# Altium schematic sheet tms320f28388d_core_board_b.SchDoc
size A3; SheetNumber: 2; SheetTotal: 3
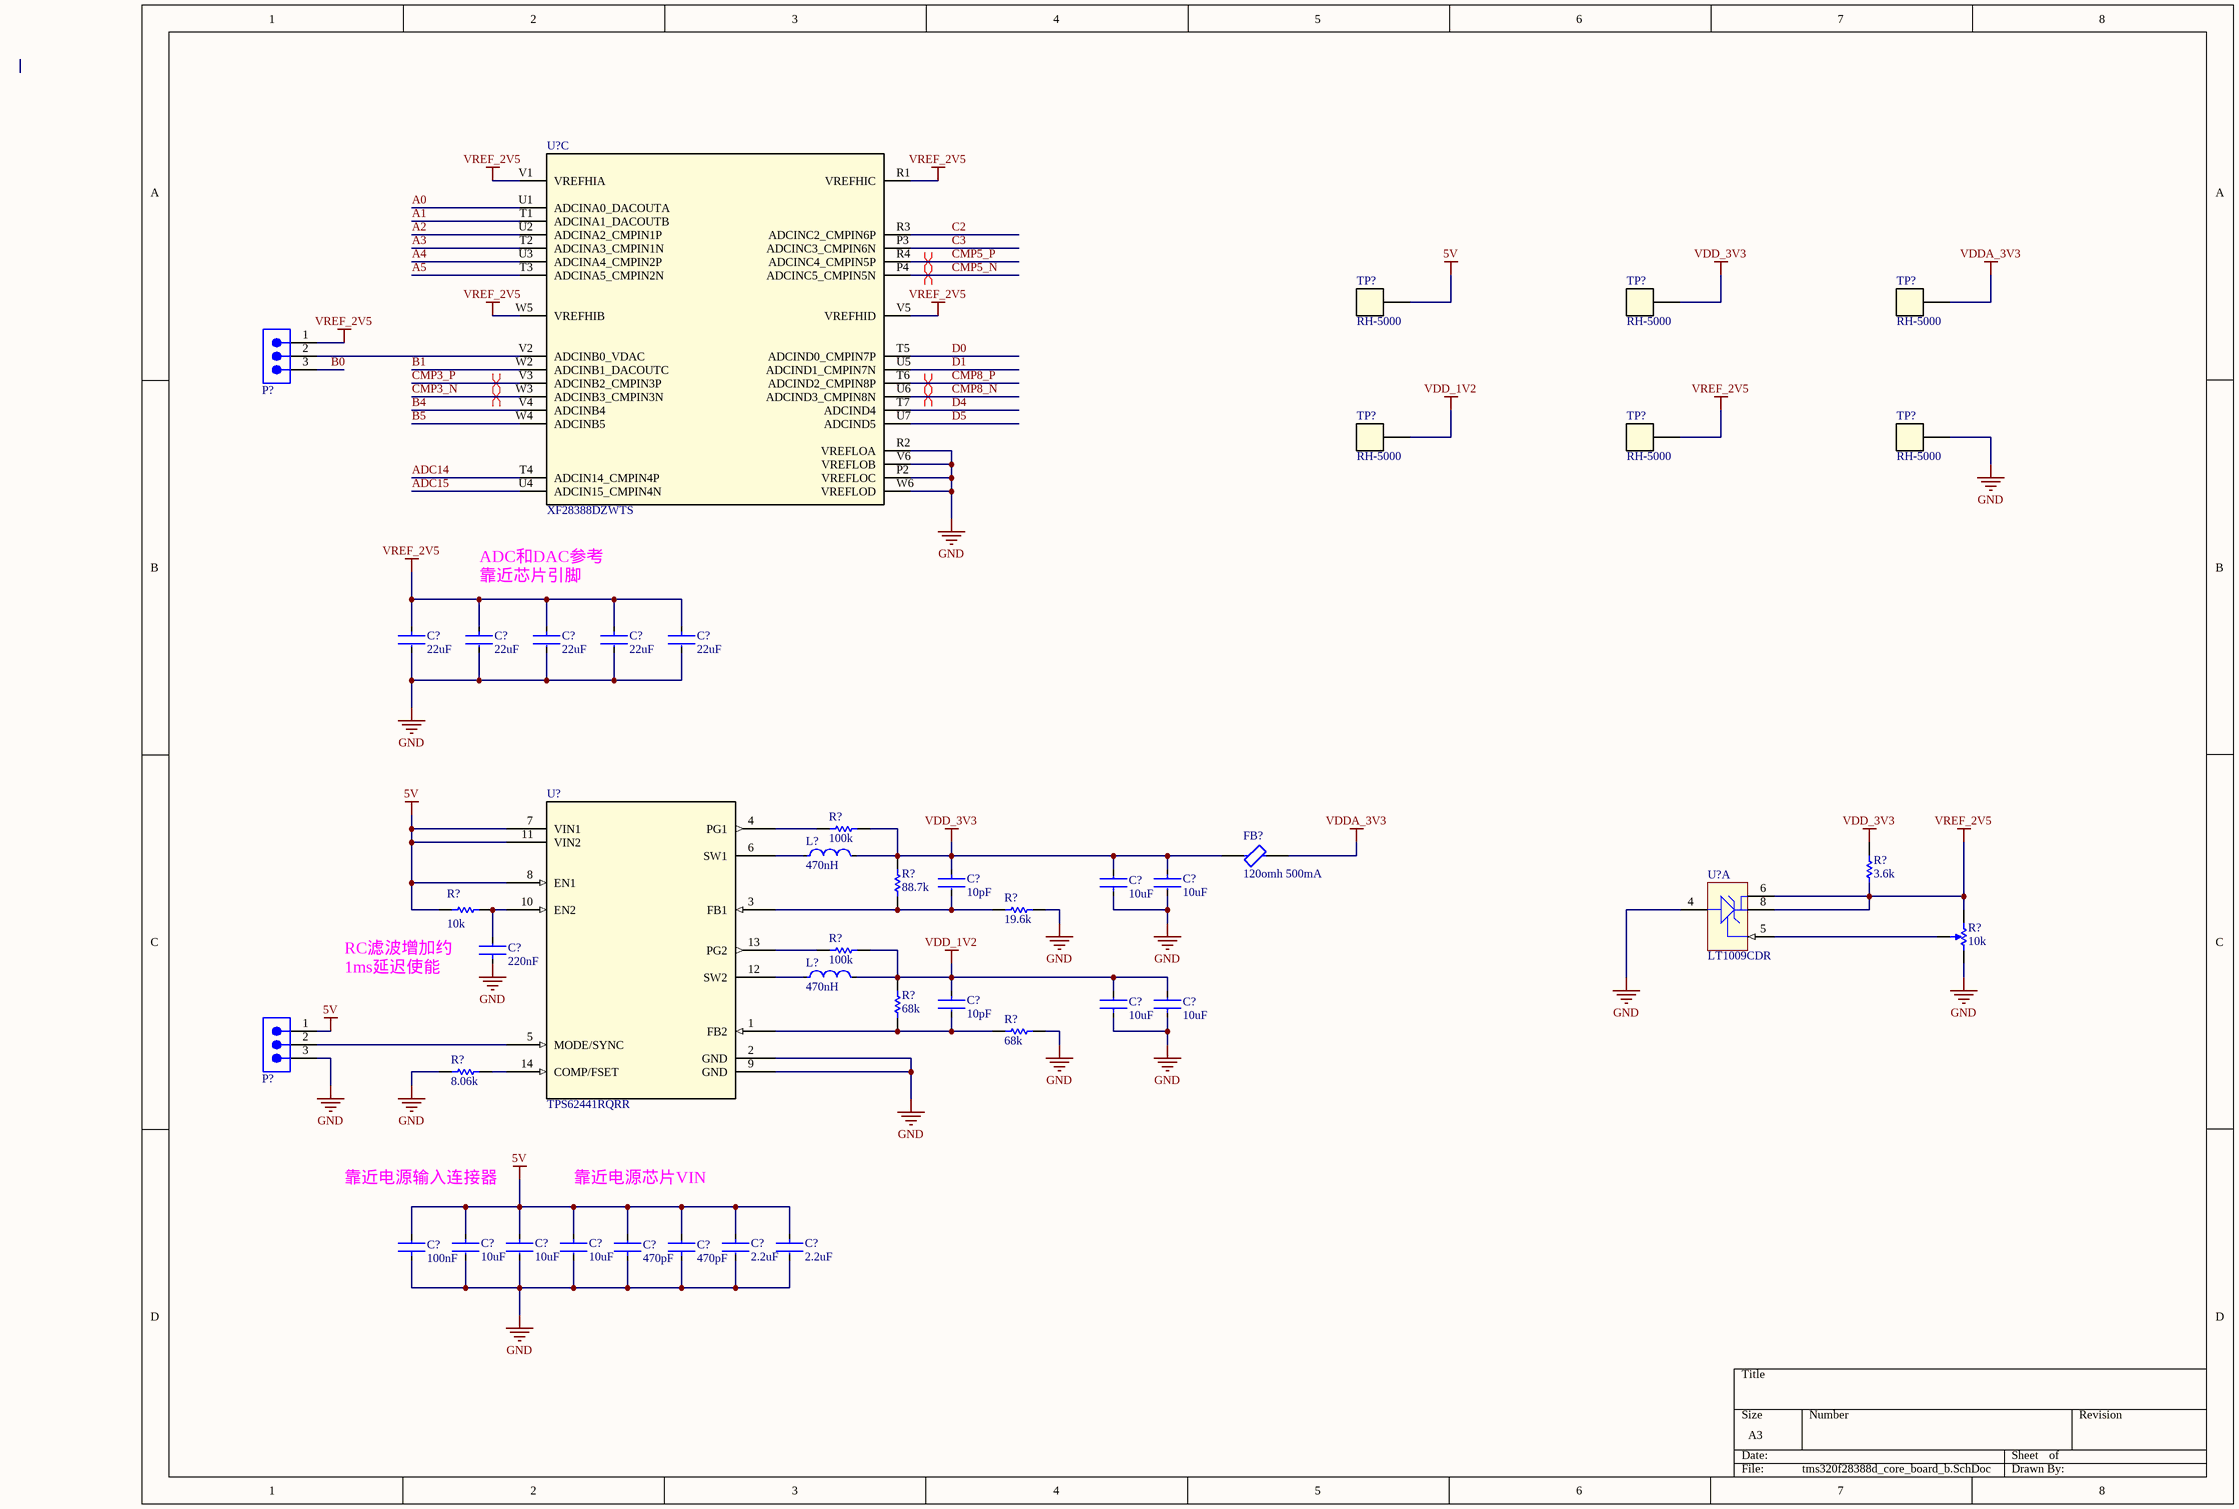
[diagram p0: tms320f28388d_core_board_b.SchDoc]

## Parts
(Parts that share a designator on the sheet are numbered #1, #2 ... from top to bottom, then left to right.)
C?#1  22uF  [FP-GRM158-0_2-MFG]
C?#2  22uF  [FP-GRM158-0_2-MFG]
C?#3  22uF  [FP-GRM158-0_2-MFG]
C?#4  22uF  [FP-GRM158-0_2-MFG]
C?#5  22uF  [FP-GRM158-0_2-MFG]
C?#6  10pF  [FP-GCM155-0_05-MFG]
C?#7  10uF  [FP-GRM188-0_2-MFG]
C?#8  10uF  [FP-GRM188-0_2-MFG]
C?#9  220nF  [FP-GRM155-0_05-MFG]
C?#10  10pF  [FP-GCM155-0_05-MFG]
C?#11  10uF  [FP-GRM188-0_2-MFG]
C?#12  10uF  [FP-GRM188-0_2-MFG]
C?#13  10uF  [FP-GRM188-0_2-MFG]
C?#14  10uF  [FP-GRM188-0_2-MFG]
C?#15  10uF  [FP-GRM188-0_2-MFG]
C?#16  2.2uF  [FP-GRM188-0_1-e0_2_0_5-MFG]
C?#17  2.2uF  [FP-GRM188-0_1-e0_2_0_5-MFG]
C?#18  100nF  [FP-CC0402-MFG]
C?#19  470pF  [FP-0402-L_1_0_1-W_0_5_0_1-MFG]
C?#20  470pF  [FP-0402-L_1_0_1-W_0_5_0_1-MFG]
FB?  120omh 500mA  [FP-MMZ1005-MFG]
L?#1  470nH  [FP-DFE252012C-MFG]
L?#2  470nH  [FP-DFE252012C-MFG]
P?#1  TSW-103-07-G-S  [SMTC-TSW-103-07-X-S]  (value not drawn)
P?#2  TSW-103-07-G-S  [SMTC-TSW-103-07-X-S]  (value not drawn)
R?#1  100k  [RESC1005X40X25NL05T10]
R?#2  3.6k  [RESC1005X40X25ML05T10]
R?#3  88.7k  [RESC1005X40X25NL05T05]
R?#4  19.6k  [RESC1005X40X25NL05T05]
R?#5  10k  [FP-RT0402-MFG]
R?#6  10k  [BOUR-TC33X-2_V]
R?#7  100k  [RESC1005X40X25NL05T10]
R?#8  68k  [RESC1005X40X25NL05T05]
R?#9  68k  [RESC1005X40X25NL05T05]
R?#10  8.06k  [RESC1005X40X25NL05T05]
TP?#1  RH-5000  [FP-5000-MFG]
TP?#2  RH-5000  [FP-5000-MFG]
TP?#3  RH-5000  [FP-5000-MFG]
TP?#4  RH-5000  [FP-5000-MFG]
TP?#5  RH-5000  [FP-5000-MFG]
TP?#6  RH-5000  [FP-5000-MFG]
U?#1  XF28388DZWTS  [ZWT0337A-MFG]  (part C of 8)
U?#2  TPS62441RQRR  [VQFN-HR14_RQR_TEX]
U?#3  LT1009CDR  [D0008A_N]  (part A of 2)

## Nets
5V: C?#13.1 C?#14.1 C?#15.1 C?#16.1 C?#17.1 C?#18.2 C?#19.2 C?#20.2 P?#2.1 R?#5.2 TP?#1.1 U?#2.7(VIN1) U?#2.8(EN1) U?#2.11(VIN2)
GND: C?#1.2 C?#2.2 C?#3.2 C?#4.2 C?#5.2 C?#7.2 C?#8.1 C?#9.1 C?#11.1 C?#12.1 C?#13.2 C?#14.2 C?#15.2 C?#16.2 C?#17.2 C?#18.1 C?#19.1 C?#20.1 P?#2.3 R?#4.2 R?#6.3 R?#9.2 R?#10.2 TP?#6.1 U?#1.P2(VREFLOC) U?#1.R2(VREFLOA) U?#1.V6(VREFLOB) U?#1.W6(VREFLOD) U?#2.2(GND) U?#2.9(GND) U?#3.4(ANODE)
VDD_1V2: C?#10.1 C?#11.2 C?#12.2 L?#2.2 R?#7.1 R?#8.2 TP?#4.1
VDD_3V3: C?#6.1 C?#7.1 C?#8.2 FB?.1 L?#1.2 R?#1.1 R?#2.2 R?#3.2 TP?#2.1
VDDA_3V3: FB?.2 TP?#3.1
VREF_2V5: C?#1.1 C?#2.1 C?#3.1 C?#4.1 C?#5.1 P?#1.1 R?#2.1 R?#6.1 TP?#5.1 U?#1.R1(VREFHIC) U?#1.V1(VREFHIA) U?#1.V5(VREFHID) U?#1.W5(VREFHIB) U?#3.6(CATHODE) U?#3.8(CATHODE)
A0: U?#1.U1(ADCINA0_DACOUTA)
A1: U?#1.T1(ADCINA1_DACOUTB)
A2: U?#1.U2(ADCINA2_CMPIN1P)
A3: U?#1.T2(ADCINA3_CMPIN1N)
A4: U?#1.U3(ADCINA4_CMPIN2P)
A5: U?#1.T3(ADCINA5_CMPIN2N)
ADC14: U?#1.T4(ADCIN14_CMPIN4P)
ADC15: U?#1.U4(ADCIN15_CMPIN4N)
B0: P?#1.3
B1: U?#1.W2(ADCINB1_DACOUTC)
B4: U?#1.V4(ADCINB4)
B5: U?#1.W4(ADCINB5)
C2: U?#1.R3(ADCINC2_CMPIN6P)
C3: U?#1.P3(ADCINC3_CMPIN6N)
CMP3_N: U?#1.W3(ADCINB3_CMPIN3N)
CMP3_P: U?#1.V3(ADCINB2_CMPIN3P)
CMP5_N: U?#1.P4(ADCINC5_CMPIN5N)
CMP5_P: U?#1.R4(ADCINC4_CMPIN5P)
CMP8_N: U?#1.U6(ADCIND3_CMPIN8N)
CMP8_P: U?#1.T6(ADCIND2_CMPIN8P)
D0: U?#1.T5(ADCIND0_CMPIN7P)
D1: U?#1.U5(ADCIND1_CMPIN7N)
D4: U?#1.T7(ADCIND4)
D5: U?#1.U7(ADCIND5)
NetC?#6_2: C?#6.2 R?#3.1 R?#4.1 U?#2.3(FB1)
NetC?#9_2: C?#9.2 R?#5.1 U?#2.10(EN2)
NetC?#10_2: C?#10.2 R?#8.1 R?#9.1 U?#2.1(FB2)
NetL?#1_1: L?#1.1 U?#2.6(SW1)
NetL?#2_1: L?#2.1 U?#2.12(SW2)
NetP?#1_2: P?#1.2 U?#1.V2(ADCINB0_VDAC)
NetP?#2_2: P?#2.2 U?#2.5(MODE/SYNC)
NetR?#1_2: R?#1.2 U?#2.4(PG1)
NetR?#6_2: R?#6.2 U?#3.5(ADJ)
NetR?#7_2: R?#7.2 U?#2.13(PG2)
NetR?#10_1: R?#10.1 U?#2.14(COMP/FSET)

## Layout directives
differential pair: CMP3_N, CMP3_P, CMP5_N, CMP5_P, CMP8_N, CMP8_P

## Notes on the sheet
- (near C?#2) ADC和DAC参考靠近芯片引脚
- RC滤波增加约1ms延迟使能
- (near C?#18) 靠近电源输入连接器
- (near C?#19) 靠近电源芯片VIN

## Library data of the parts
C?#1-C?#5 = GRM158C80G226ME01D: Chip Multilayer Ceramic Capacitors for General Purpose, 0402, 22uF, X6S, 22%, 20%, 4V
C?#6 C?#10 = GCM1555C1H100JA16D: Ceramic Capacitor for Automotive 10pF ±5% 50VDC C0G 0402 Paper T/R; Voltage Rating: 50V; Case/Package: 0402; Dielectric: C0G; Package Quantity: 10000; Ratings: AEC-Q200; Max Operating Temperature: 125°C; Width: 0.02inch; REACH SVHC: No SVHC; Mount: Surface Mount; Min Operating Temperature: -55°C; Lead Free: Lead Free; Packaging: Tape and Reel; Capacitance: 10pF; Case Code (Imperial): 0402; Tolerance: 5%; Height: 0.5mm; Thickness: 0.022inch; Length: 0.039inch; Case Code (Metric): 1005; Weight: 0.000212oz; Voltage Rating (DC): 50V; Termination: SMD/SMT
C?#7 C?#8 C?#11-C?#15 = GRM188Z71A106MA73D: Chip Multilayer Ceramic Capacitors for General Purpose, 0603, 10uF, X7R, 15%, 20%, 10V; Case/Package: 0603
C?#9 = GRM155R61H224KE01D: Multilayer Ceramic Capacitor 0.22uF 10% 50V X5R 0402 Paper T/R
C?#16 C?#17 = GRM188C70J225KE20D: Chip Multilayer Ceramic Capacitors for General Purpose, 0603, 2.2uF, X7S, 22%, 10%, 6.3V; Thickness: 0.035inch; Length: 1.6mm; Packaging: Tape and Reel; Tolerance: 10%; Number of Pins: 2; Depth: 0.8mm; Voltage Rating: 6.3V; Voltage Rating (DC): 6.3V; Lead Pitch: 0.5mm; Dielectric: X7S; Case Code (Imperial): 0603; Weight: 7.1E-05oz; Min Operating Temperature: -55°C; Width: 0.031inch; Termination: SMD/SMT; Height: 0.8mm; REACH SVHC: No SVHC; Radiation Hardening: No; Case Code (Metric): 1608; Mount: Surface Mount; Package Quantity: 4000; Max Operating Temperature: 125°C; Case/Package: 0603; Capacitance: 2.2uF
C?#18 = CC0402KRX7R7BB104: CAP CER 0.1UF 16V X7R 0402; Manufacturer: YAGEO; Material: Ceramic; Automotive Grade: NA; Temperature Coefficient: 30ppm/°C; Tolerance: 0.1; Device Class L1: Passive Components; Temperature Range Low: -55°C; Device Class L3: Ceramic Capacitors; Temperature Characteristic: X7R; Ipc Land Pattern Name: CAPC10050X50; Capacitance: 100 nF; Temperature Range High: +125°C; Voltage Rating: 16 V; Temperature: -55°C to +125°C; RoHS: TRUE; Automotive: No; Height: 0.55mm; Device Class L2: Capacitors; Digikey Description: CAP CER 0.1UF 16V X7R 0402; Package: CC0402; Footprint Url: http://www.yageo.com/exep/pages/download/literatures/UPY-C_GEN_24.pdf; ComponentLink2Description: Datasheet; Category: Cap; Lead Free: Yes; Value: 100 nF; Octopart: https://octopart.com/cc0402krx7r7bb104-yageo-42244624; ComponentLink2URL: http://www.yageo.com/documents/recent/UPY-GP_NP0_16V-to-50V_16.pdf; Manufacturer Part Number: CC0402KRX7R7BB104; Mouser Description: 0402 0.1 uF 16 V ±10 % Tolerance X7R SMT Multilayer Ceramic Capacitor
C?#19 C?#20 = CC0402KRX7R9BB471: General Purpose Ceramic Capacitor, 0402, 470pF, 10%, X7R, 15%, 50V; Series: -; Height: 0.5mm; Termination: SMD/SMT; Packaging: Tape and Reel; Tolerance: 10%; REACH SVHC: No SVHC; Package Quantity: 10000; Case Code (Imperial): 0402; Voltage: 50V; Depth: 0.5mm; Case Code (Metric): 1005; Voltage Rating: 50V; Radiation Hardening: No; Construction: Flat; Mount: Surface Mount; Dielectric: X7R; Min Operating Temperature: -55°C; Width: 0.5mm; Number of Pins: 2; Case/Package: 0402; RoHS Compliant: Yes; Thickness: 0.022inch; Lead Free: Lead Free; Voltage Rating (DC): 50V; Max Operating Temperature: 125°C; Capacitance: 470pF; Length: 1mm; Contact Plating: Tin
FB? = MMZ1005S121CT000: Signal Line Ferrite Bead 120Ω @ 100MHz 500mA DCR 220mΩ SMD 0402; DC Resistance (DCR): 250mR; Tolerance: 25%; Impedance: 120R; Series: MMZ; Height: 0.022inch; RoHS Compliant: Yes; Package Quantity: 1; REACH SVHC: No SVHC; Lead Free: Lead Free; Current Rating: 500mA; Packaging: Tape and Reel; Case Code (Imperial): 0402; Width: 0.02inch; Max DC Current: 500mA; Core Material: Ferrite; Case Code (Metric): 1005; Depth: 0.5mm; Case/Package: 0402; Mount: Surface Mount; Length: 0.039inch
L?#1 L?#2 = DFE252012P-R47M=P2: Shielded Wirewound Inductor 0.47uH 20% 4000mA 0.027Ω 1008 (2520); Test Frequency: 1MHz; Max DC Current: 4A; DC Resistance (DCR): 27mR; Core Material: Ferrite; Current Rating: 5.7A; Min Operating Temperature: -40°C; Depth: 2mm; Case/Package: 1008; Width: 0.079inch; Length: 0.098inch; Max Operating Temperature: 125°C; Tolerance: 20%; Case Code (Imperial): 1008; Mount: Surface Mount; Inductance: 470nH; Packaging: Tape and Reel; Height - Seated (Max): 0.039inch; Case Code (Metric): 2520; Resistor Type: Wirewound; Shielding: Shielded
P?#1 P?#2 = TSW-103-07-G-S: 0.025" SQ Post Header, Through-hole, Vertical, -55 to 125 degC, 2.54 mm Pitch, 3-Pin, Male, RoHS; Manufacturer: Samtec; Pitch: 2.54 mm; ComponentLink3URL: http://www.samtec.com/documents/webfiles/cpdf/TSW-XXX-XX-XXX-X-XX-XXX-MKT.pdf; Temperature Range: -55 to 125 degC; DatasheetVersion: F-214; ComponentLink1Description: Manufacturer URL; ComponentLink2URL: http://www.samtec.com/documents/webfiles/pdf/TSW_TH.PDF; RoHS: True; Orientation: Vertical; ComponentLink2Description: Datasheet; ComponentLink3Description: Package Specification; PackageDescription: .025[0.64] SQ. Post Terminal Strip Assembly; Mounting Technology: Through-hole; PackageVersion: DM, 8/1988; ComponentLink1URL: http://www.samtec.com; PackageReference: TSW-103-07-X-S; PartNumber: TSW-103-07-G-S
R?#1 R?#7 = RC0402FR-07100KL: Manufacturer: Yageo / Phycomp; Part Number: RC0402FR-07100KL
R?#2 = RC0402FR-073K6L: Manufacturer: Yageo / Phycomp; Part Number: RC0402FR-073K6L
R?#3 = ERJ-2RKF8872X: Manufacturer: Panasonic; Part Number: ERJ-2RKF8872X
R?#4 = ERJ2RKF1962X: Manufacturer: Panasonic; Part Number: ERJ-2RKF8872X
R?#5 = RC0402FR-0710KL: Manufacturer: Yageo / Phycomp; Part Number: RC0402FR-0710KL
R?#6 = TC33X-2-103E: Trimming Potentiometer, 10000 Ohm, -40 to 100 degC, 3-Pin SMD, RoHS, Tape and Reel; Manufacturer: Bourns; Tolerance: 25%; Max Power Dissipation: 100mW; Number of Turns: 1; Resistance: 10KOhm; Temperature Coefficient: 250ppm/degreesC; Voltage Rating (DC): 50V; Datasheet URL: http://www.bourns.com/docs/Product-Datasheets/TC33.pdf; Composition: Potentiometer; Package Description: 3-Pin Surface Mount Device, Body 3.8 x 3.6 mm; Weight: 29.4mg; Power Rating: 100mW; Termination: FootPrint; Manufacturer URL: http://www.bourns.com/; Width: 0.118inch; Height: 0.047inch; Military Standard: Not; Radiation Hardening: No; Colour: Silver; Case/Package: SMD/SMT; Depth: 3.8mm; Min Operating Temperature: -40degC; Lead Free: LeadFree; Datasheet Version: 42583.0; REACH SVHC: NoSVHC; Length: 3mm; RoHSCompliant: true; Contact Plating: Silver; Taper: Linear; Packaging: TapeandReel; Mount: SurfaceMount; Max Operating Temperature: 100degC; Package Reference: TC33X-2; Package Quantity: 2500
R?#8 R?#9 = ERJ2RKF6802X: Manufacturer: Panasonic; Part Number: ERJ-2RKF8872X
R?#10 = ERJ-2RKF8061X: Manufacturer: Panasonic; Part Number: ERJ-2RKF8061X
TP?#1-TP?#6 = RH-5000: PC TEST POINT MINIATURE RED; Outside Diameter: 2.54mm; Body Material: Bronze; Number of Contacts: 1; Insulation: Insulated; Inside Diameter: 1.27mm; Hole Diameter: 1.6mm; Plating: Silver; Length: 7.62mm; Package Quantity: 100; Number of Ports: 1; Contact Material: Bronze; Orientation: Straight; RoHS Compliant: Yes; Housing Color: Red; Height: 0.3inch; Series: THM; Lead Free: Lead Free; Color: Red; Contact Plating: Tin; Mount: PCB; Packaging: Bulk; REACH SVHC: No SVHC; Flammability Rating: UL94 V-0; Material: Nylon
U?#1 = XF28388DZWTS: C2000 32-bit MCU w/ connectivity manager, 2x C28x+CLA CPU, 1.5 MB flash, FPU64, CLB, ENET, EtherCAT 337-NFBGA -40 to 125; Manufacturer_Name: Texas Instruments; TYPE: TYPE; RefDes: RefDes; Copyright: Copyright (C) 2026 Ultra Librarian. All rights reserved.; Manufacturer_Part_Number: XF28388DZWTS
U?#2 = TPS62441RQRR: 2.75-V to 6-V, dual 1-A step-down converter in QFN package 14-VQFN-HR -40 to 150; Manufacturer_Name: Texas Instruments; Type: Power Management; Copyright: Copyright (C) 2026 Ultra Librarian. All rights reserved.; Manufacturer_Part_Number: TPS62441RQRR; RefDes: RefDes
U?#3 = LT1009CDR: Integrated Reference Circuit, 2.5 V, 15 ppm / degC, 10 mA, 0 to 70 degC, 8-pin SOIC (D), Green (RoHS & no Sb/Br); Manufacturer: Texas Instruments; VO(V): 2.5; Initial Accuracy @ 25/deg C(%): 0.2; SubFamily: Shunt Voltage Reference; Temp Coeff(Typ)(ppm/ degree C): 15; Min Iz for Regulation(uA): 400; Rating: Catalog; Iout/Iz(Max)(mA): 10; Temp Coeff(Max)(ppm/ degree C): 25; ComponentLink3Description: Package Specification; ComponentLink1URL: http://www.ti.com/; ComponentLink2URL: http://www.ti.com/general/docs/lit/getliterature.tsp?genericPartNumber=LT1009&fileType=pdf; DatasheetVersion: SLVS013N; PackageDescription: 8-Pin Plastic Small Outline, Body 4.9 x 3.9 mm, Pitch 1.27 mm; ComponentLink1Description: Manufacturer URL; PackageReference: D0008A; ComponentLink2Description: Datasheet; PartNumber: LT1009CDR; Mounting Technology: Surface Mount; Eco-Plan: Green (RoHS & no Sb/Br); PackageVersion: 4040047-3/M; Code_JEDEC: MS-012; ComponentLink3URL: http://www.ti.com/litv/pdf/msoi002j